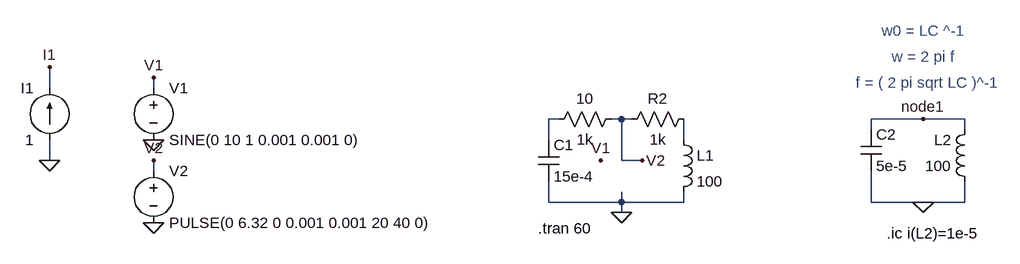
[diagram p0: schematic L_C_behaviors.asc]
L_C_behaviors.asc, the LTspice schematic file:
Version 4.1
SHEET 1 880 680
WIRE -720 16 -720 -16
WIRE -560 16 -560 0
WIRE 64 64 48 64
WIRE 160 64 144 64
WIRE 176 64 160 64
WIRE 624 64 544 64
WIRE 688 64 624 64
WIRE 544 80 544 64
WIRE 688 80 688 64
WIRE 48 96 48 64
WIRE 256 96 256 64
WIRE -720 128 -720 96
WIRE 160 128 160 64
WIRE 192 128 160 128
WIRE -560 144 -560 128
WIRE 48 192 48 160
WIRE 160 192 160 176
WIRE 160 192 48 192
WIRE 256 192 256 176
WIRE 256 192 160 192
WIRE 544 192 544 144
WIRE 624 192 544 192
WIRE 688 192 688 160
WIRE 688 192 624 192
WIRE 160 208 160 192
FLAG 160 208 0
FLAG 128 128 V1
FLAG 192 128 V2
FLAG -560 224 0
FLAG -560 96 0
FLAG -560 0 V1
FLAG -560 128 V2
FLAG 624 64 node1
FLAG 624 192 0
FLAG -720 128 0
FLAG -720 -16 I1
SYMBOL cap 32 96 R0
SYMATTR InstName C1
SYMATTR Value 15e-4
SYMBOL ind 240 80 R0
SYMATTR InstName L1
SYMATTR Value 100
SYMBOL voltage -560 0 R0
WINDOW 123 0 0 Left 0
WINDOW 39 0 0 Left 0
SYMATTR InstName V1
SYMATTR Value SINE(0 10 1 0.001 0.001 0)
SYMBOL res 160 48 R90
WINDOW 0 0 56 VBottom 2
WINDOW 3 32 56 VTop 2
SYMATTR InstName 10
SYMATTR Value 1k
SYMBOL res 160 80 R270
WINDOW 0 32 56 VTop 2
WINDOW 3 0 56 VBottom 2
SYMATTR InstName R2
SYMATTR Value 1k
SYMBOL voltage -560 128 R0
WINDOW 123 0 0 Left 0
WINDOW 39 0 0 Left 0
SYMATTR InstName V2
SYMATTR Value PULSE(0 6.32 0 0.001 0.001 20 40 0)
SYMBOL cap 528 80 R0
SYMATTR InstName C2
SYMATTR Value 5e-5
SYMBOL ind 704 176 R180
WINDOW 0 36 80 Left 2
WINDOW 3 36 40 Left 2
SYMATTR InstName L2
SYMATTR Value 100
SYMBOL current -720 96 R180
WINDOW 0 24 80 Left 2
WINDOW 3 24 0 Left 2
WINDOW 123 0 0 Left 0
WINDOW 39 0 0 Left 0
SYMATTR InstName I1
SYMATTR Value 1
TEXT 32 232 Left 2 !.tran 60
TEXT 576 -32 Left 2 ;w = 2 pi f
TEXT 520 8 Left 2 ;f = ( 2 pi sqrt LC )^-1
TEXT 560 -72 Left 2 ;w0 = LC ^-1
TEXT 568 240 Left 2 !.ic i(L2)=1e-5

The netlist it stands for:
* L_C_behaviors.asc
C1 N001 0 15e-4
L1 N002 0 100
V1 V1 0 SINE(0 10 1 0.001 0.001 0)
R§10 V2 N001 1k
R2 V2 N002 1k
V2 V2 0 PULSE(0 6.32 0 0.001 0.001 20 40 0)
C2 node1 0 5e-5
L2 0 node1 100
I1 0 I1 1
.tran 60
* w = 2 pi f
* f = ( 2 pi sqrt LC )^-1
* w0 = LC ^-1
.ic i(L2)=1e-5
.backanno
.end